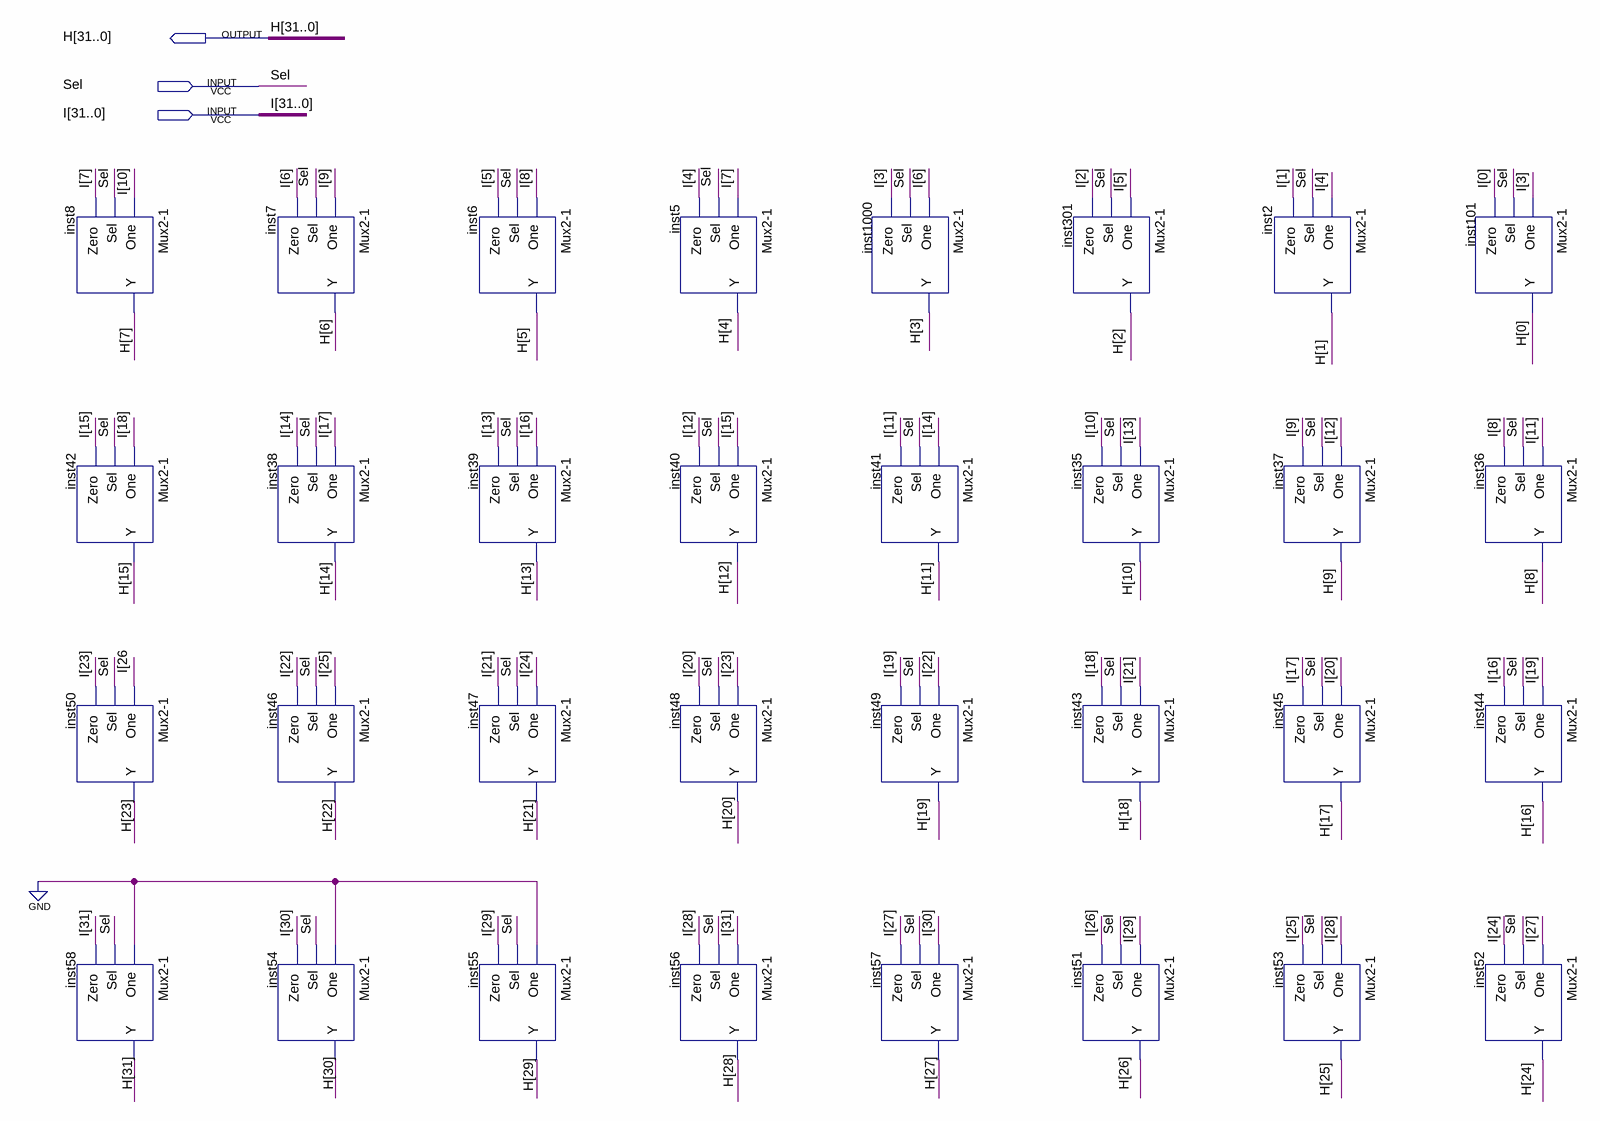
[diagram p0: schematic sheet]
// Quartus schematic ShiftLeft3(32bits).bdf as structural Verilog: 32 symbols, 3 pins
module \ShiftLeft3(32bits)  (
  input  Sel,
  input  [31:0] I,
  output [31:0] H
);

  wire \I[26 ;

  \Mux2-1  inst8 (.One(I[10]), .Sel(Sel), .Zero(I[7]), .Y(H[7]));
  \Mux2-1  inst42 (.One(I[18]), .Sel(Sel), .Zero(I[15]), .Y(H[15]));
  \Mux2-1  inst50 (.One(\I[26 ), .Sel(Sel), .Zero(I[23]), .Y(H[23]));
  \Mux2-1  inst58 (.One(1'b0), .Sel(Sel), .Zero(I[31]), .Y(H[31]));
  \Mux2-1  inst7 (.One(I[9]), .Sel(Sel), .Zero(I[6]), .Y(H[6]));
  \Mux2-1  inst38 (.One(I[17]), .Sel(Sel), .Zero(I[14]), .Y(H[14]));
  \Mux2-1  inst46 (.One(I[25]), .Sel(Sel), .Zero(I[22]), .Y(H[22]));
  \Mux2-1  inst54 (.One(1'b0), .Sel(Sel), .Zero(I[30]), .Y(H[30]));
  \Mux2-1  inst6 (.One(I[8]), .Sel(Sel), .Zero(I[5]), .Y(H[5]));
  \Mux2-1  inst39 (.One(I[16]), .Sel(Sel), .Zero(I[13]), .Y(H[13]));
  \Mux2-1  inst47 (.One(I[24]), .Sel(Sel), .Zero(I[21]), .Y(H[21]));
  \Mux2-1  inst55 (.One(1'b0), .Sel(Sel), .Zero(I[29]), .Y(H[29]));
  \Mux2-1  inst5 (.One(I[7]), .Sel(Sel), .Zero(I[4]), .Y(H[4]));
  \Mux2-1  inst40 (.One(I[15]), .Sel(Sel), .Zero(I[12]), .Y(H[12]));
  \Mux2-1  inst48 (.One(I[23]), .Sel(Sel), .Zero(I[20]), .Y(H[20]));
  \Mux2-1  inst56 (.One(I[31]), .Sel(Sel), .Zero(I[28]), .Y(H[28]));
  \Mux2-1  inst1000 (.One(I[6]), .Sel(Sel), .Zero(I[3]), .Y(H[3]));
  \Mux2-1  inst41 (.One(I[14]), .Sel(Sel), .Zero(I[11]), .Y(H[11]));
  \Mux2-1  inst49 (.One(I[22]), .Sel(Sel), .Zero(I[19]), .Y(H[19]));
  \Mux2-1  inst57 (.One(I[30]), .Sel(Sel), .Zero(I[27]), .Y(H[27]));
  \Mux2-1  inst301 (.One(I[5]), .Sel(Sel), .Zero(I[2]), .Y(H[2]));
  \Mux2-1  inst35 (.One(I[13]), .Sel(Sel), .Zero(I[10]), .Y(H[10]));
  \Mux2-1  inst43 (.One(I[21]), .Sel(Sel), .Zero(I[18]), .Y(H[18]));
  \Mux2-1  inst51 (.One(I[29]), .Sel(Sel), .Zero(I[26]), .Y(H[26]));
  \Mux2-1  inst2 (.One(I[4]), .Sel(Sel), .Zero(I[1]), .Y(H[1]));
  \Mux2-1  inst37 (.One(I[12]), .Sel(Sel), .Zero(I[9]), .Y(H[9]));
  \Mux2-1  inst45 (.One(I[20]), .Sel(Sel), .Zero(I[17]), .Y(H[17]));
  \Mux2-1  inst53 (.One(I[28]), .Sel(Sel), .Zero(I[25]), .Y(H[25]));
  \Mux2-1  inst101 (.One(I[3]), .Sel(Sel), .Zero(I[0]), .Y(H[0]));
  \Mux2-1  inst36 (.One(I[11]), .Sel(Sel), .Zero(I[8]), .Y(H[8]));
  \Mux2-1  inst44 (.One(I[19]), .Sel(Sel), .Zero(I[16]), .Y(H[16]));
  \Mux2-1  inst52 (.One(I[27]), .Sel(Sel), .Zero(I[24]), .Y(H[24]));
endmodule
